# EAGLE design ExenMiniMotorShield (EAGLE 8.6.3)

## Sheet 1 of 2
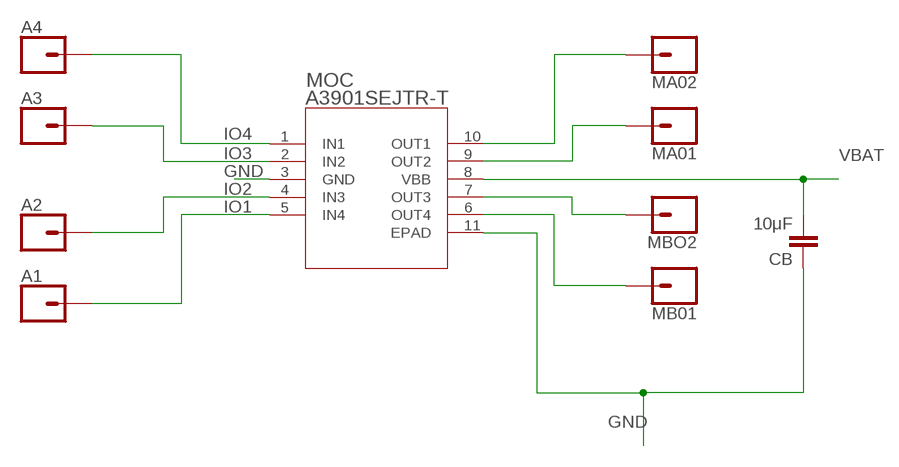
[diagram p0: schematic, sheet 1]

### Parts
A1  CONN_01PTH_NO_SILK_YES_STOP  [1X01_NO_SILK]
A2  CONN_01PTH_NO_SILK_YES_STOP  [1X01_NO_SILK]
A3  CONN_01PTH_NO_SILK_YES_STOP  [1X01_NO_SILK]
A4  CONN_01PTH_NO_SILK_YES_STOP  [1X01_NO_SILK]
CB  10μF  4.7PF-0603-50V-5%  [0603]
MA01  CONN_01PTH_NO_SILK_YES_STOP  [1X01_NO_SILK]
MA02  CONN_01PTH_NO_SILK_YES_STOP  [1X01_NO_SILK]
MB01  CONN_01PTH_NO_SILK_YES_STOP  [1X01_NO_SILK]
MBO2  CONN_01PTH_NO_SILK_YES_STOP  [1X01_NO_SILK]
MOC  A3901SEJTR-T  [DFN-10_DD]

### Nets
GND: CB.1 MOC.3(GND) MOC.11(EPAD) ; also sheet 2
IO1: A1.1 MOC.5(IN4)
IO2: A2.1 MOC.4(IN3)
IO3: A3.1 MOC.2(IN2)
IO4: A4.1 MOC.1(IN1)
MA01: MBO2.1 MOC.7(OUT3)
MA02: MB01.1 MOC.6(OUT4)
MB01: MA02.1 MOC.10(OUT1)
MB02: MA01.1 MOC.9(OUT2)
VBAT: CB.2 MOC.8(VBB) ; also sheet 2

## Sheet 2 of 2
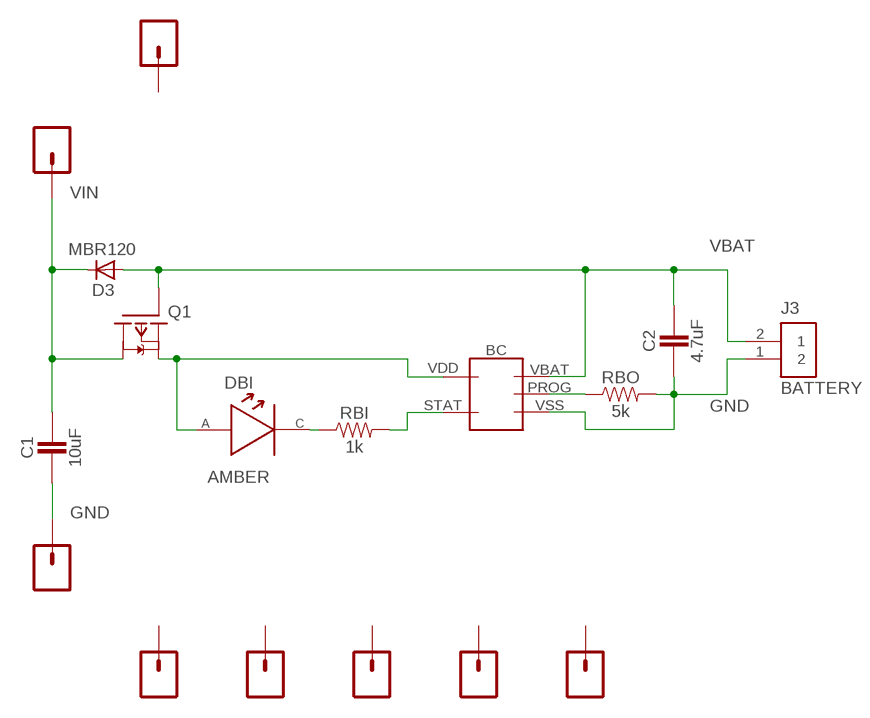
[diagram p1: schematic, sheet 2]

### Parts
+3.3  CONN_01PTH_NO_SILK_YES_STOP  [1X01_NO_SILK]
BC  BATTERYCHARGER  [SOT-753]
C1  10uF  CAPACITOR  [PASSIVE-0603]
C2  4.7uF  CAPACITOR  [PASSIVE-0603]
D0  CONN_01PTH_NO_SILK_YES_STOP  [1X01_NO_SILK]
D1  CONN_01PTH_NO_SILK_YES_STOP  [1X01_NO_SILK]
D3  MBR120  AS-ITM-00111  [SOD-123FL]
DBI  AMBER  DIODE  [PASSIVE-0603]
GND  CONN_01PTH_NO_SILK_YES_STOP  [1X01_NO_SILK]
J3  BATTERY  AS-ITM-00231  [JST_SH_2X1]
Q1  DMP2035U  AS-ITM-00024  [SOT23]
RBI  1k  RESISTOR  [PASSIVE-0603]
RBO  5k  RESISTOR  [PASSIVE-0603]
RST  CONN_01PTH_NO_SILK_YES_STOP  [1X01_NO_SILK]
SCL  CONN_01PTH_NO_SILK_YES_STOP  [1X01_NO_SILK]
SDA  CONN_01PTH_NO_SILK_YES_STOP  [1X01_NO_SILK]
VIN  CONN_01PTH_NO_SILK_YES_STOP  [1X01_NO_SILK]

### Nets
GND: BC.VSS C1.1 C2.1 GND.1 J3.1 RBO.2 ; also sheet 1
N$1: DBI.2(CATHODE) RBI.1
N$2: BC.STAT RBI.2
N$3: BC.PROG RBO.1
VBAT: BC.VBAT C2.2 D3.A J3.2 Q1.B(G) ; also sheet 1
VDD: BC.VDD DBI.1(ANODE) Q1.E(S)
VIN: C1.2 D3.C Q1.C(D) VIN.1
Unconnected: +3.3.1 D0.1 D1.1 RST.1 SCL.1 SDA.1

## Library data of the parts
+3.3 A1-A4 D0 D1 GND MA01 MA02 MB01 MBO2 RST SCL SDA VIN = SparkFun-Connectors:CONN_01: Single connection point. Often used as Generic Header-pin footprint for 0.1 inch spaced/style header connections On any of the 0.1 inch spaced packages, you can populate with these: Break Away Headers - Straight <https://www.sparkfun.com/products/116> (PRT-00116) Break Away Male Headers - Right Angle <https://www.sparkfun.com/products/553> (PRT-00553) Female Headers <https://www.sparkfun.com/products/115> (PRT-00115) Break Away Headers - Machine Pin <https://www.sparkfun.com/products/117> (PRT-00117) Break Away Female Headers - Swiss Machine Pin <https://www.sparkfun.com/products/743> (PRT-00743) This device is also useful as a general connection point to wire up your design to another part of your project. Our various solder wires solder well into these plated through hole pads. Hook-Up Wire - Assortment (Stranded, 22 AWG) <https://www.sparkfun.com/products/11375> (PRT-11375) Hook-Up Wire - Assortment (Solid Core, 22 AWG) <https://www.sparkfun.com/products/11367> (PRT-11367) View the entire wire category on our website here <https://www.sparkfun.com/categories/141> Special notes: SMTSO-256-ET is a "flush mount" nut for a 4-40 screw. We mostly use this on specialty testbeds; it is a nice way to connect hardware to your PCB at an adjustable hieght. Also note, the SNAP packages are for using a snappable style connector. We sell a baggie of snaps and they are also used on two LilyPad designs: Snap Assortment - 30 pack (male and female) <https://www.sparkfun.com/products/11347> (DEV-11347) LilyPad Arduino SimpleSnap <https://www.sparkfun.com/products/10941> (DEV-10941) LilyPad SimpleSnap Protoboard <https://www.sparkfun.com/products/10940> (DEV-10940)
BC = ZippyComponentLibrary:BATTERYCHARGER: "Provides a soldering placement for a 3x2 right-angle header."
C1 C2 = ZippyComponentLibrary:CAPACITOR
CB = SparkFun-Capacitors:4.7PF: 4.7pF ceramic capacitors A capacitor is a passive two-terminal electrical component used to store electrical energy temporarily in an electric field.; PROD_ID: CAP-07880; VALUE: 4.7pF
D3 = tinycircuits:AS-ITM-00111: DIODE SCHOTTKY 20V 1A SOD123L; PARTNO: AS-ITM-00111; VALUE: MBR120VLSFT1G
DBI = ZippyComponentLibrary:DIODE: 2x1 SMD Diode Mounting Point
J3 = tinycircuits:AS-ITM-00231: CONN HEADER SH 2POS SIDE 1MM; PARTNO: AS-ITM-00231; PNPROTATION: 180; VALUE: SM02B-SRSS-TB(LF)(SN)
MOC = ZippyComponentLibrary:A3901SEJTR-T
Q1 = tinycircuits:AS-ITM-00024: P-Channel MOSFET SOT-23; PARTNO: AS-ITM-00024; PNPROTATION: 0
RBI RBO = ZippyComponentLibrary:RESISTOR

## Board
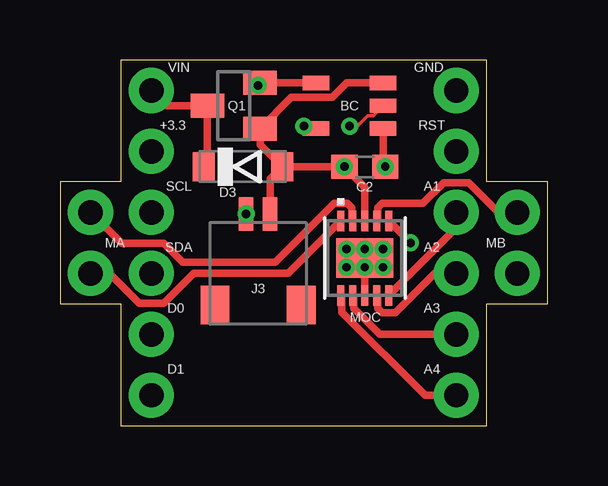
[diagram p2: board, top side]
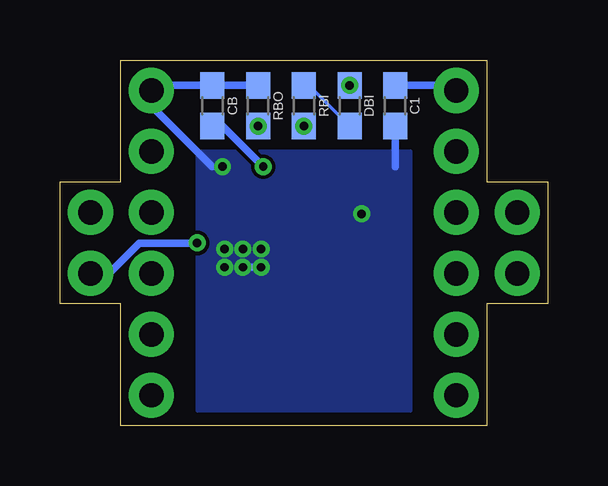
[diagram p3: board, bottom side, seen from below]

Size 20.32 x 15.24 mm. Coordinates in mm from the lower left corner, seen from the top.
Outline: 2.54,0 17.78,0 17.78,5.08 20.32,5.08 20.32,10.16 17.78,10.16 17.78,15.24 2.54,15.23 2.54,10.16 0,10.16 0,5.08 2.54,5.08 2.54,0
Copper layers (1*16): Top 0.0356mm / dielectric 1.5011mm / Bottom 0.0356mm
Design rules "LaenPCBOrder *": minimum track width 6mil, minimum drill 13mil, track to track 6mil, track to pad 6mil, pad to pad 6mil, via to via 6mil, smd to smd 6mil, copper to edge 12mil, drill to drill 6mil, minimum pad ring 7mil, minimum via ring 7mil, stop-mask expansion 3mil, vias tented up to drill 0mil, thermal gap 10mil

### Footprints (pad centres in the part's own frame; a part is rotated, then mirrored left to right if it is on the bottom)
1X01_NO_SILK = drill 1.016 pad 1.88: 1 0,0
SOT-753 = smd 0.6 x 1.1: PROG 0,-1.4; STAT -0.95,1.4; VBAT 0.95,-1.4; VDD 0.95,1.4; VSS -0.95,-1.4
PASSIVE-0603 = smd 1.1 x 1: 1 -0.85,0; 2 0.85,0
0603 = smd 1.1 x 1: 1 -0.85,0; 2 0.85,0
SOD-123FL = smd 0.914 x 1.219: A 1.638,0; C -1.638,0
JST_SH_2X1 = smd 0.6 x 1.4: 1 -0.5,2.475; 2 0.5,2.475 | smd 1.2 x 1.6: PAD1 -1.8,-1.325; PAD2 1.8,-1.325
DFN-10_DD = smd 0.85 x 0.3: 1 -1.55,1; 2 -1.55,0.5; 3 -1.55,0; 4 -1.55,-0.5; 5 -1.55,-1; 6 1.55,-1; 7 1.55,-0.5; 8 1.55,0; 9 1.55,0.5; 10 1.55,1 | smd 1.65 x 2.38: 11 0,0
SOT23 = smd 1 x 1.4: B -0.95,-1.1; C 0,1.1; E 0.95,-1.1

### Placement (x,y rotation side)
+3.3  3.81,11.43 0 top
A1  16.51,8.89 0 top
A2  16.51,6.35 0 top
A3  16.51,3.81 0 top
A4  16.51,1.27 0 top
BC  12.06,13.34 90 top
C1  6.35,13.34 90 bottom
C2  12.7,10.79 180 top
CB  13.97,13.34 270 bottom
D0  3.81,3.81 0 top
D1  3.81,1.27 0 top
D3  7.62,10.79 0 top
DBI  8.26,13.34 270 bottom
GND  16.51,13.97 0 top
J3  8.26,6.35 0 top
MA01  1.27,8.89 0 top
MA02  1.27,6.35 0 top
MB01  19.05,6.35 0 top
MBO2  19.05,8.89 0 top
MOC  12.7,6.99 90 top
Q1  7.24,13.34 90 top
RBI  10.16,13.34 270 bottom
RBO  12.06,13.34 90 bottom
RST  16.51,11.43 0 top
SCL  3.81,8.89 0 top
SDA  3.81,6.35 0 top
VIN  3.81,13.97 0 top

### Tracks (layer width: path | path; a pad name or v marks a point on that pad's centre or on a via)
GND  (via drill 0.35)
  Top 0.305: 13.08,7.37 v13.46,7.37 | 12.32,6.6 MOC.11 v12.7,6.6 MOC.3 | C2.1 13.46,10.88 BC.VSS
  Bottom 0.305: C1.1 6.35,10.79 | v7.75,8.82 7.69,8.89 7.62,8.89 | RBO.2 CB.1 16.3,14.19 GND.1 16.51,13.34 13.97,10.79 | v11.94,6.6 v12.7,6.6
  other vias: 13.46,6.6 11.94,7.37 12.7,7.37 13.55,10.79
  pour Bottom: 14.61,11.43 5.71,11.43 5.71,0.64 14.61,0.64
IO1
  Top 0.305: MOC.5 16.51,8.24 A1.1
IO2
  Top 0.305: MOC.4 13.24,5.39 13.24,4.89 13.42,4.71 13.98,4.71 15.62,6.35 A2.1
IO3
  Top 0.305: MOC.2 12.24,5.39 12.24,4.89 13.32,3.81 A3.1
IO4
  Top 0.305: MOC.1 11.74,5.39 11.74,4.74 15.21,1.27 A4.1
MA01
  Top 0.305: MOC.7 13.24,8.58 13.24,9.08 13.42,9.27 15.12,9.27 15.99,10.13 17.03,10.13 18.27,8.89 MBO2.1
MA02  (via drill 0.35)
  Top 0.305: MOC.6 v14.61,7.63 v14.61,7.62
  Bottom 0.305: v14.61,7.62 14.63,7.59 17.03,7.59 18.27,6.35 MB01.1
MB01
  Top 0.305: MOC.10 9.52,6.35 5.57,6.35 4.33,5.11 3.29,5.11 2.05,6.35 MA02.1
MB02
  Top 0.305: MOC.9 12.16,8.58 12.16,9.08 11.98,9.27 11.42,9.27 8.97,6.81 5.11,6.81 4.33,7.59 2.56,7.59 MA01.1
N$1
  Bottom 0.152: DBI.2 9.96,14.19 RBI.1
N$2  (via drill 0.35)
  Top 0.305: BC.STAT 10.26,12.38 v10.16,12.48
N$3  (via drill 0.35)
  Top 0.152: BC.PROG 13.04,12.91 12.82,12.91 12.39,12.48 v12.06,12.48
VBAT  (via drill 0.35)
  Top 0.305: D3.A 8.34,11.71 Q1.B 9.63,13.68 11.34,13.68 11.95,14.29 BC.VBAT | D3.A C2.2 12.7,9.95 MOC.8 | D3.A 8.76,10.29 J3.2
  Bottom 0.305: C2.2 12.69,11.63 13.55,12.48 CB.2
  other vias: 11.85,10.79
VDD  (via drill 0.35)
  Top 0.305: BC.VDD Q1.E 8.26,14.2 DBI.1
  other vias: 8.26,14.19
VIN
  Top 0.305: VIN.1 4.45,13.34 Q1.C 6.14,10.95 D3.C
  Bottom 0.305: VIN.1 4.03,14.19 C1.2

### Text on the board
tNames: MA | MB